# EAGLE design FA_2021_PCB (EAGLE 9.6.2)
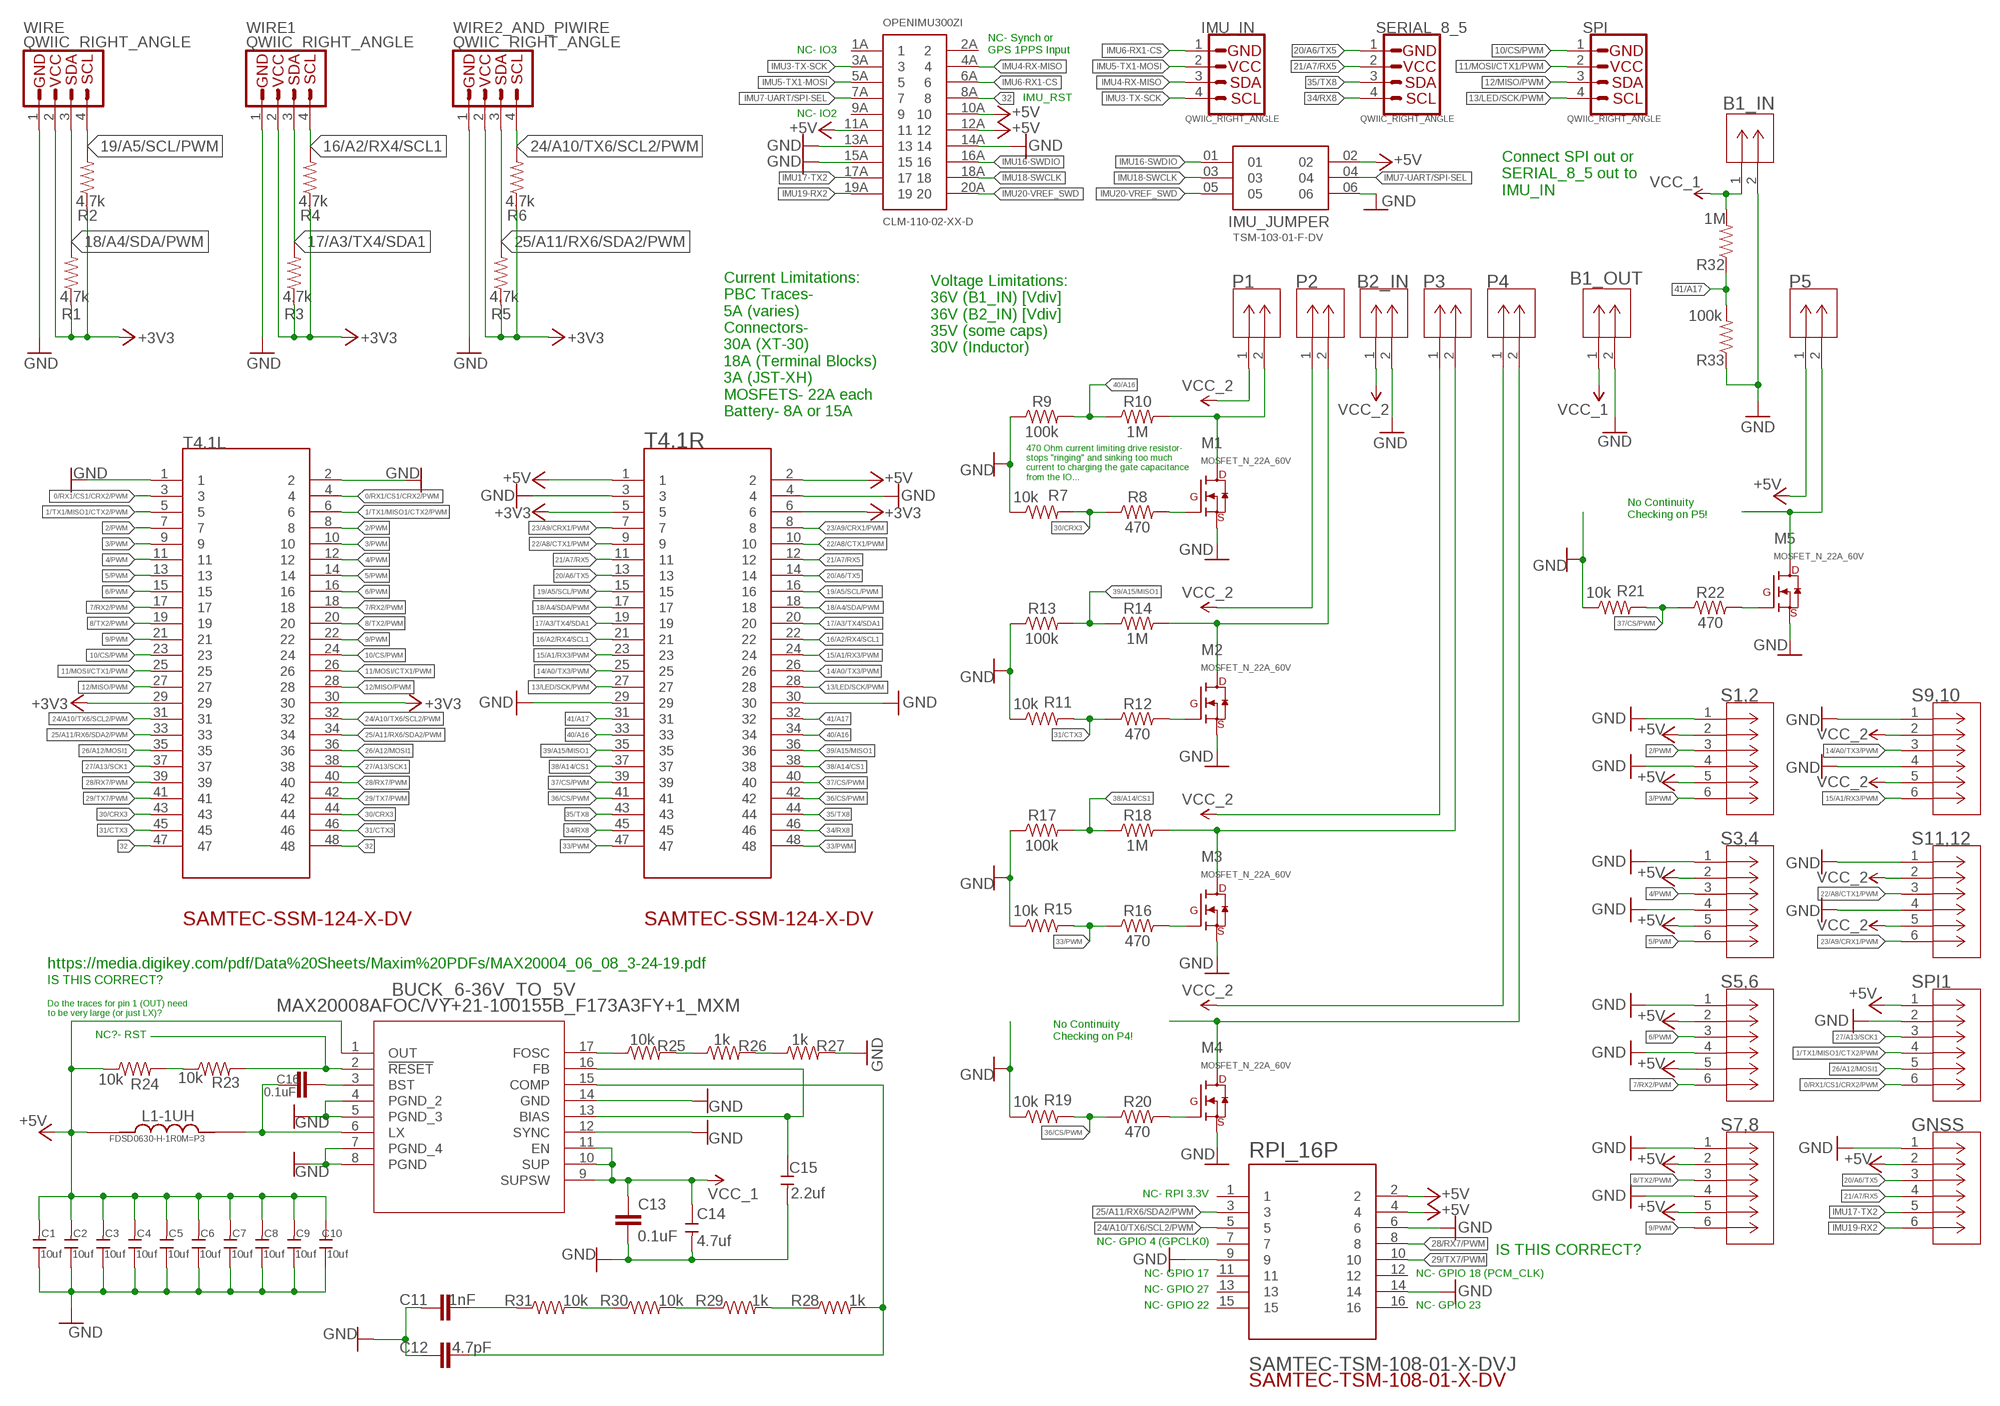
[diagram p0: schematic, sheet 1]

## Parts
B1_IN  TERMINAL_BLOCK_2P_5MMCONN_1935161_PXC  [CONN_1935161_PXC]
B1_OUT  TERMINAL_BLOCK_2P_5MMCONN_1935161_PXC  [CONN_1935161_PXC]
B2_IN  TERMINAL_BLOCK_2P_5MMCONN_1935161_PXC  [CONN_1935161_PXC]
BUCK_6-36V_TO_5V  MAX20008AFOC/VY+21-100155B_F173A3FY+1_MXM  [21-100155B_F173A3FY+1_MXM]
C1  10uf  CERAMIC-10UF-25V-10%-X5R(1206)  [C1206]
C2  10uf  CERAMIC-10UF-25V-10%-X5R(1206)  [C1206]
C3  10uf  CERAMIC-10UF-25V-10%-X5R(1206)  [C1206]
C4  10uf  CERAMIC-10UF-25V-10%-X5R(1206)  [C1206]
C5  10uf  CERAMIC-10UF-25V-10%-X5R(1206)  [C1206]
C6  10uf  CERAMIC-10UF-25V-10%-X5R(1206)  [C1206]
C7  10uf  CERAMIC-10UF-25V-10%-X5R(1206)  [C1206]
C8  10uf  CERAMIC-10UF-25V-10%-X5R(1206)  [C1206]
C9  10uf  CERAMIC-10UF-25V-10%-X5R(1206)  [C1206]
C10  10uf  CERAMIC-10UF-25V-10%-X5R(1206)  [C1206]
C11  1nF  1.0NF/1000PF-0603-50V-10%  [0603]
C12  4.7pF  4.7PF-0603-50V-5%  [0603]
C13  0.1uF  0.1UF-0603-100V-10%  [0603]
C14  4.7uf  CERAMIC-4.7UF-25V-10%-X5R(0805)  [C0805]
C15  2.2uf  CERAMIC-2.2UF-25V-10%-X7R(0805)  [C0805]
C16  0.1uF  0.1UF-0603-100V-10%  [0603]
GNSS  S6B-XH-SM4-TB(LF)(SN)CONN_S6B-XH-SM4-TB_JST  [CONN_S6B-XH-SM4-TB_JST]
IMU_IN  QWIIC_RIGHT_ANGLE  QWIIC_CONNECTORJS-1MM  [JST04_1MM_RA]
IMU_JUMPER  TSM-103-01-F-DV  [SAMTEC_TSM-103-01-F-DV]
L1-1UH  FDSD0630-H-1R0M=P3  [IND_FDSD0630-H-1R0M=P3]
M1  MOSFET_N_22A_60V  [SOT-669_LFPAK56_POWERSO8]
M2  MOSFET_N_22A_60V  [SOT-669_LFPAK56_POWERSO8]
M3  MOSFET_N_22A_60V  [SOT-669_LFPAK56_POWERSO8]
M4  MOSFET_N_22A_60V  [SOT-669_LFPAK56_POWERSO8]
M5  MOSFET_N_22A_60V  [SOT-669_LFPAK56_POWERSO8]
OPENIMU300ZI  CLM-110-02-XX-D  [CLM-110-02-XX-D_MOD]
P1  TERMINAL_BLOCK_2P_5MMCONN_1935161_PXC  [CONN_1935161_PXC]
P2  TERMINAL_BLOCK_2P_5MMCONN_1935161_PXC  [CONN_1935161_PXC]
P3  TERMINAL_BLOCK_2P_5MMCONN_1935161_PXC  [CONN_1935161_PXC]
P4  TERMINAL_BLOCK_2P_5MMCONN_1935161_PXC  [CONN_1935161_PXC]
P5  TERMINAL_BLOCK_2P_5MMCONN_1935161_PXC  [CONN_1935161_PXC]
R1  4.7k  4.7KOHM-0603-1/10W-1%  [0603]
R2  4.7k  4.7KOHM-0603-1/10W-1%  [0603]
R3  4.7k  4.7KOHM-0603-1/10W-1%  [0603]
R4  4.7k  4.7KOHM-0603-1/10W-1%  [0603]
R5  4.7k  4.7KOHM-0603-1/10W-1%  [0603]
R6  4.7k  4.7KOHM-0603-1/10W-1%  [0603]
R7  10k  10KOHM-0603-1/10W-1%  [0603]
R8  470  470OHM-0603-1/10W-1%  [0603]
R9  100k  100KOHM-0603-1/10W-1%  [0603]
R10  1M  1MOHM-0603-1/4W-5%  [0603]
R11  10k  10KOHM-0603-1/10W-1%  [0603]
R12  470  470OHM-0603-1/10W-1%  [0603]
R13  100k  100KOHM-0603-1/10W-1%  [0603]
R14  1M  1MOHM-0603-1/4W-5%  [0603]
R15  10k  10KOHM-0603-1/10W-1%  [0603]
R16  470  470OHM-0603-1/10W-1%  [0603]
R17  100k  100KOHM-0603-1/10W-1%  [0603]
R18  1M  1MOHM-0603-1/4W-5%  [0603]
R19  10k  10KOHM-0603-1/10W-1%  [0603]
R20  470  470OHM-0603-1/10W-1%  [0603]
R21  10k  10KOHM-0603-1/10W-1%  [0603]
R22  470  470OHM-0603-1/10W-1%  [0603]
R23  10k  10KOHM-0603-1/10W-1%  [0603]
R24  10k  10KOHM-0603-1/10W-1%  [0603]
R25  10k  10KOHM-0603-1/10W-1%  [0603]
R26  1k  1KOHM-0603-1/10W-1%  [0603]
R27  1k  1KOHM-0603-1/10W-1%  [0603]
R28  1k  1KOHM-0603-1/10W-1%  [0603]
R29  1k  1KOHM-0603-1/10W-1%  [0603]
R30  10k  10KOHM-0603-1/10W-1%  [0603]
R31  10k  10KOHM-0603-1/10W-1%  [0603]
R32  1M  1MOHM-0603-1/4W-5%  [0603]
R33  100k  100KOHM-0603-1/10W-1%  [0603]
RPI_16P  SAMTEC-TSM-108-01-X-DVJ  [SAMTEC-TSM-108-01-X-DV]
S1,2  S6B-XH-SM4-TB(LF)(SN)CONN_S6B-XH-SM4-TB_JST  [CONN_S6B-XH-SM4-TB_JST]
S3,4  S6B-XH-SM4-TB(LF)(SN)CONN_S6B-XH-SM4-TB_JST  [CONN_S6B-XH-SM4-TB_JST]
S5,6  S6B-XH-SM4-TB(LF)(SN)CONN_S6B-XH-SM4-TB_JST  [CONN_S6B-XH-SM4-TB_JST]
S7,8  S6B-XH-SM4-TB(LF)(SN)CONN_S6B-XH-SM4-TB_JST  [CONN_S6B-XH-SM4-TB_JST]
S9,10  S6B-XH-SM4-TB(LF)(SN)CONN_S6B-XH-SM4-TB_JST  [CONN_S6B-XH-SM4-TB_JST]
S11,12  S6B-XH-SM4-TB(LF)(SN)CONN_S6B-XH-SM4-TB_JST  [CONN_S6B-XH-SM4-TB_JST]
SERIAL_8_5  QWIIC_RIGHT_ANGLE  QWIIC_CONNECTORJS-1MM  [JST04_1MM_RA]
SPI  QWIIC_RIGHT_ANGLE  QWIIC_CONNECTORJS-1MM  [JST04_1MM_RA]
SPI1  S6B-XH-SM4-TB(LF)(SN)CONN_S6B-XH-SM4-TB_JST  [CONN_S6B-XH-SM4-TB_JST]
T4.1L  SAMTEC-SSM-124-X-DVJ  [SAMTEC-SSM-124-X-DV]
T4.1R  SAMTEC-SSM-124-X-DVJ  [SAMTEC-SSM-124-X-DV]
WIRE  QWIIC_RIGHT_ANGLE  QWIIC_CONNECTORJS-1MM  [JST04_1MM_RA]
WIRE1  QWIIC_RIGHT_ANGLE  QWIIC_CONNECTORJS-1MM  [JST04_1MM_RA]
WIRE2_AND_PIWIRE  QWIIC_RIGHT_ANGLE  QWIIC_CONNECTORJS-1MM  [JST04_1MM_RA]

## Nets
0/RX1/CS1/CRX2/PWM: SPI1.6 T4.1L.3 T4.1L.4
1/TX1/MISO1/CTX2/PWM: SPI1.4 T4.1L.5 T4.1L.6
2/PWM: S1,2.3 T4.1L.7 T4.1L.8
3/PWM: S1,2.6 T4.1L.9 T4.1L.10
4/PWM: S3,4.3 T4.1L.11 T4.1L.12
5/PWM: S3,4.6 T4.1L.13 T4.1L.14
6/PWM: S5,6.3 T4.1L.15 T4.1L.16
7/RX2/PWM: S5,6.6 T4.1L.17 T4.1L.18
8/TX2/PWM: S7,8.3 T4.1L.19 T4.1L.20
9/PWM: S7,8.6 T4.1L.21 T4.1L.22
10/CS/PWM: SPI.1 T4.1L.23 T4.1L.24
11/MOSI/CTX1/PWM: SPI.2 T4.1L.25 T4.1L.26
12/MISO/PWM: SPI.3 T4.1L.27 T4.1L.28
13/LED/SCK/PWM: SPI.4 T4.1R.27 T4.1R.28
14/A0/TX3/PWM: S9,10.3 T4.1R.25 T4.1R.26
15/A1/RX3/PWM: S9,10.6 T4.1R.23 T4.1R.24
16/A2/RX4/SCL1: R4.2 T4.1R.21 T4.1R.22 WIRE1.4
17/A3/TX4/SDA1: R3.2 T4.1R.19 T4.1R.20 WIRE1.3
18/A4/SDA/PWM: R1.2 T4.1R.17 T4.1R.18 WIRE.3
19/A5/SCL/PWM [Power Delivery]: R2.2 T4.1R.15 T4.1R.16 WIRE.4
20/A6/TX5: GNSS.3 SERIAL_8_5.1 T4.1R.13 T4.1R.14
21/A7/RX5: GNSS.4 SERIAL_8_5.2 T4.1R.11 T4.1R.12
22/A8/CTX1/PWM: S11,12.3 T4.1R.9 T4.1R.10
23/A9/CRX1/PWM: S11,12.6 T4.1R.7 T4.1R.8
24/A10/TX6/SCL2/PWM: R6.2 RPI_16P.5 T4.1L.31 T4.1L.32 WIRE2_AND_PIWIRE.4
25/A11/RX6/SDA2/PWM: R5.2 RPI_16P.3 T4.1L.33 T4.1L.34 WIRE2_AND_PIWIRE.3
26/A12/MOSI1 [Power Delivery]: SPI1.5 T4.1L.35 T4.1L.36
27/A13/SCK1: SPI1.3 T4.1L.37 T4.1L.38
28/RX7/PWM: RPI_16P.8 T4.1L.39 T4.1L.40
29/TX7/PWM: RPI_16P.10 T4.1L.41 T4.1L.42
30/CRX3: R7.2 R8.1 T4.1L.43 T4.1L.44
31/CTX3: R11.2 R12.1 T4.1L.45 T4.1L.46
32: OPENIMU300ZI.8A T4.1L.47 T4.1L.48
33/PWM: R15.2 R16.1 T4.1R.47 T4.1R.48
34/RX8: SERIAL_8_5.4 T4.1R.45 T4.1R.46
35/TX8: SERIAL_8_5.3 T4.1R.43 T4.1R.44
36/CS/PWM: R19.2 R20.1 T4.1R.41 T4.1R.42
37/CS/PWM: R21.2 R22.1 T4.1R.39 T4.1R.40
38/A14/CS1: R17.2 R18.1 T4.1R.37 T4.1R.38
39/A15/MISO1: R13.2 R14.1 T4.1R.35 T4.1R.36
40/A16: R9.2 R10.1 T4.1R.33 T4.1R.34
41/A17: R32.1 R33.2 T4.1R.31 T4.1R.32
+3V3: R1.1 R2.1 R3.1 R4.1 R5.1 R6.1 T4.1L.29 T4.1L.30 T4.1R.5 T4.1R.6 WIRE1.2 WIRE2_AND_PIWIRE.2 WIRE.2
+5V: BUCK_6-36V_TO_5V.1(OUT) C1.2 C2.2 C3.2 C4.2 C5.2 C6.2 C7.2 C8.2 C9.2 C10.2 GNSS.2 IMU_JUMPER.02 L1-1UH.1 OPENIMU300ZI.10A OPENIMU300ZI.11A OPENIMU300ZI.12A P5.1 R24.1 RPI_16P.2 RPI_16P.4 S1,2.2 S1,2.5 S3,4.2 S3,4.5 S5,6.2 S5,6.5 S7,8.2 S7,8.5 SPI1.1 T4.1R.1 T4.1R.2
BIAS/FB: BUCK_6-36V_TO_5V.13(BIAS) BUCK_6-36V_TO_5V.16(FB) C15.1
BST: BUCK_6-36V_TO_5V.3(BST) C16.2
BUCK_RST: BUCK_6-36V_TO_5V.2(!RESET) R23.2
COMP: BUCK_6-36V_TO_5V.15(COMP) C12.2 R28.2
FOSC: BUCK_6-36V_TO_5V.17(FOSC) R25.1
GND: B1_IN.2 B1_OUT.2 B2_IN.2 BUCK_6-36V_TO_5V.4(PGND_2) BUCK_6-36V_TO_5V.5(PGND_3) BUCK_6-36V_TO_5V.7(PGND_4) BUCK_6-36V_TO_5V.8(PGND) BUCK_6-36V_TO_5V.12(SYNC) BUCK_6-36V_TO_5V.14(GND) C1.1 C2.1 C3.1 C4.1 C5.1 C6.1 C7.1 C8.1 C9.1 C10.1 C11.1 C12.1 C13.2 C14.2 C15.2 GNSS.1 IMU_JUMPER.06 M1.1(S) M1.2(S) M1.3(S) M2.1(S) M2.2(S) M2.3(S) M3.1(S) M3.2(S) M3.3(S) M4.1(S) M4.2(S) M4.3(S) M5.1(S) M5.2(S) M5.3(S) OPENIMU300ZI.13A OPENIMU300ZI.14A OPENIMU300ZI.15A R7.1 R9.1 R11.1 R13.1 R15.1 R17.1 R19.1 R21.1 R27.2 R33.1 RPI_16P.6 RPI_16P.9 RPI_16P.14 S1,2.1 S1,2.4 S3,4.1 S3,4.4 S5,6.1 S5,6.4 S7,8.1 S7,8.4 S9,10.1 S9,10.4 S11,12.1 S11,12.4 SPI1.2 T4.1L.1 T4.1L.2 T4.1R.3 T4.1R.4 T4.1R.29 T4.1R.30 WIRE1.1 WIRE2_AND_PIWIRE.1 WIRE.1
IMU3-TX-SCK: IMU_IN.4 OPENIMU300ZI.3A
IMU4-RX-MISO: IMU_IN.3 OPENIMU300ZI.4A
IMU5-TX1-MOSI: IMU_IN.2 OPENIMU300ZI.5A
IMU6-RX1-CS: IMU_IN.1 OPENIMU300ZI.6A
IMU7-UART/SPI-SEL: IMU_JUMPER.04 OPENIMU300ZI.7A
IMU16-SWDIO: IMU_JUMPER.01 OPENIMU300ZI.16A
IMU17-TX2: GNSS.5 OPENIMU300ZI.17A
IMU18-SWCLK: IMU_JUMPER.03 OPENIMU300ZI.18A
IMU19-RX2: GNSS.6 OPENIMU300ZI.19A
IMU20-VREF_SWD: IMU_JUMPER.05 OPENIMU300ZI.20A
LX: BUCK_6-36V_TO_5V.6(LX) C16.1 L1-1UH.2
N$2: M1.4(G) R8.2
N$5: M5.4(G) R22.2
N$8: R23.1 R24.2
N$10: M2.4(G) R12.2
N$12: R25.2 R26.1
N$13: R26.2 R27.1
N$14: R30.1 R31.2
N$15: R29.1 R30.2
N$16: R28.1 R29.2
N$17: M3.4(G) R16.2
N$19: C11.2 R31.1
N$24: M4.4(G) R20.2
P1D: M1.5(D) P1.2 R10.2
P2D: M2.5(D) P2.2 R14.2
P3D: M3.5(D) P3.2 R18.2
P4D: M4.5(D) P4.2
P5D: M5.5(D) P5.2
VCC_1: B1_IN.1 B1_OUT.1 BUCK_6-36V_TO_5V.9(SUPSW) BUCK_6-36V_TO_5V.10(SUP) BUCK_6-36V_TO_5V.11(EN) C13.1 C14.1 R32.2
VCC_2: B2_IN.1 P1.1 P2.1 P3.1 P4.1 S9,10.2 S9,10.5 S11,12.2 S11,12.5
Unconnected: OPENIMU300ZI.1A OPENIMU300ZI.2A OPENIMU300ZI.9A RPI_16P.1 RPI_16P.7 RPI_16P.11 RPI_16P.12 RPI_16P.13 RPI_16P.15 RPI_16P.16

## Notes on the sheet
- NC- IO3
- NC- Synch or 
  GPS 1PPS Input
- IMU_RST
- NC- IO2
- Connect SPI out or 
  SERIAL_8_5 out to 
  IMU_IN
- Voltage Limitations:
  36V (B1_IN) [Vdiv]
  36V (B2_IN) [Vdiv]
  35V (some caps)
  30V (Inductor)
- Current Limitations:
  PBC Traces- 
  5A (varies)
  Connectors- 
  30A (XT-30)
  18A (Terminal Blocks)
  3A (JST-XH)
  MOSFETS- 22A each
  Battery- 8A or 15A
- 470 Ohm current limiting drive resistor-
  stops "ringing" and sinking too much
  current to charging the gate capacitance 
  from the IO...
- No Continuity 
  Checking on P5!
- https://media.digikey.com/pdf/Data%20Sheets/Maxim%20PDFs/MAX20004_06_08_3-24-19.pdf
- IS THIS CORRECT?
- Do the traces for pin 1 (OUT) need 
  to be very large (or just LX)?
- NC?- RST
- No Continuity 
  Checking on P4!
- NC- RPI 3.3V
- NC- GPIO 4 (GPCLK0)
- IS THIS CORRECT?
- NC- GPIO 17 | NC- GPIO 18 (PCM_CLK)
- NC- GPIO 27
- NC- GPIO 22 | NC- GPIO 23

## Library data of the parts
B1_IN B1_OUT B2_IN P1-P5 = Terminal_Block_2p_5mm:TERMINAL_BLOCK_2P_5MM; BUILT_BY: EMA_Justin; COPYRIGHT: Copyright (C) 2018 Accelerated Designs. All rights reserved; MANUFACTURER_PART_NUMBER: 1935161; SOURCELIBRARY: Phoenix_Contact_2019-12-04; VENDOR: Phoenix Contact
BUCK_6-36V_TO_5V = MAX20008AFOC_Library:MAX20008AFOC/VY+; BUILT_BY: EMA_Jessica; COPYRIGHT: Copyright (C) 2018 Accelerated Designs. All rights reserved; MANUFACTURER_PART_NUMBER: MAX20008AFOC/VY+; SOURCELIBRARY: Maxim_2019-06-26; VENDOR: Maxim Integrated Products
C1-C10 = OPL_Capacitor:CERAMIC-10UF-25V-10%-X5R(1206): 302010181; MPN: CC1206KKX5R8BB106
C11 = SparkFun-Capacitors:1.0NF/1000PF: 1nF/1,000pF ceramic capacitors A capacitor is a passive two-terminal electrical component used to store electrical energy temporarily in an electric field.; PROD_ID: CAP-07886
C12 = SparkFun-Capacitors:4.7PF: 4.7pF ceramic capacitors A capacitor is a passive two-terminal electrical component used to store electrical energy temporarily in an electric field.; PROD_ID: CAP-07880
C13 C16 = SparkFun-Capacitors:0.1UF: 0.1µF ceramic capacitors A capacitor is a passive two-terminal electrical component used to store electrical energy temporarily in an electric field.; PROD_ID: CAP-08390
C14 = OPL_Capacitor:CERAMIC-4.7UF-25V-10%-X5R(0805): 302010146; MPN: CC0805KKX5R8BB475
C15 = OPL_Capacitor:CERAMIC-2.2UF-25V-10%-X7R(0805): 302010148; MPN: CC0805KKX7R8BB225
GNSS S1,2 S3,4 S5,6 S7,8 S9,10 S11,12 SPI1 = JST-S6B-XH-SM4:S6B-XH-SM4-TB(LF)(SN); BUILT_BY: EMA_Cory; COPYRIGHT: Copyright (C) 2018 Accelerated Designs. All rights reserved; DATASHEET: http://www.jst-mfg.com/product/pdf/eng/eXH.pdf; MANUFACTURER_PART_NUMBER: S6B-XH-SM4-TB(LF)(SN); SOURCELIBRARY: Add_to_database_2020-12-04; VENDOR: JST
IMU_IN SERIAL_8_5 SPI WIRE WIRE1 WIRE2_AND_PIWIRE = MODIFIED-SparkFun-Connectors:QWIIC_CONNECTOR: SparkFun I2C Standard Qwiic Connector An SMD 1mm pitch JST connector makes it easy and quick (get it? Qwiic?) to connect I2C devices to each other. The Qwiic system <http://www.sparkfun.com/qwiic> enables fast and solderless connection between popular platforms and various sensors and actuators. We carry 200mm <https://www.sparkfun.com/products/14204>, 100mm <https://www.sparkfun.com/products/14205>, 50mm <https://www.sparkfun.com/products/14206>, and breadboard friendly <https://www.sparkfun.com/products/14207> Qwiic cables. We also offer 10 pcs strips <https://www.sparkfun.com/products/14323> the SMD connectors.; PROD_ID: CONN-13694
IMU_JUMPER = TSM-103-01-X-DV:TSM-103-01-F-DV; MANUFACTURER: SAMTEC
L1-1UH = FDSD0630-H-1R0M_P3:FDSD0630-H-1R0M=P3: 2.2µH Shielded Wirewound Inductor 7.1A 17mOhm Max Nonstandard; DESCRIPTION: Inductor with Inductance: 1uH Tol. +/-20%, Package: 2726 (7066); DIGI-KEY_PART_NUMBER: 490-10878-1-ND; MF: Murata; MP: FDSD0630-H-1R0M=P3; PACKAGE: NONSTANDARD
M1-M5 = BUK9Y43-60E:MOSFET_N_22A_60V
OPENIMU300ZI = CLM-110-02-XX-D:CLM-110-02-XX-D: LOW PROFILE 1MMX1MM DOUBLE ROW BODY. MANUFACTURER:SAMTEC.
R1-R6 = SparkFun-Resistors:4.7KOHM: 4.7kΩ resistor A resistor is a passive two-terminal electrical component that implements electrical resistance as a circuit element. Resistors act to reduce current flow, and, at the same time, act to lower voltage levels within circuits. - Wikipedia; PROD_ID: RES-07857
R7 R11 R15 R19 R21 R23-R25 R30 R31 = SparkFun-Resistors:10KOHM: 10kΩ resistor A resistor is a passive two-terminal electrical component that implements electrical resistance as a circuit element. Resistors act to reduce current flow, and, at the same time, act to lower voltage levels within circuits. - Wikipedia; PROD_ID: RES-00824
R8 R12 R16 R20 R22 = SparkFun-Resistors:470OHM: 470Ω resistor A resistor is a passive two-terminal electrical component that implements electrical resistance as a circuit element. Resistors act to reduce current flow, and, at the same time, act to lower voltage levels within circuits. - Wikipedia; PROD_ID: RES-07869
R9 R13 R17 R33 = SparkFun-Resistors:100KOHM: 100kΩ resistor A resistor is a passive two-terminal electrical component that implements electrical resistance as a circuit element. Resistors act to reduce current flow, and, at the same time, act to lower voltage levels within circuits. - Wikipedia; PROD_ID: RES-07828
R10 R14 R18 R32 = SparkFun-Resistors:1MOHM: 1MΩ resistor A resistor is a passive two-terminal electrical component that implements electrical resistance as a circuit element. Resistors act to reduce current flow, and, at the same time, act to lower voltage levels within circuits. - Wikipedia; PROD_ID: RES-07868
R26-R29 = SparkFun-Resistors:1KOHM: 1kΩ resistor A resistor is a passive two-terminal electrical component that implements electrical resistance as a circuit element. Resistors act to reduce current flow, and, at the same time, act to lower voltage levels within circuits. - Wikipedia; PROD_ID: RES-07856
RPI_16P = SAMTEC-TSM-108-01-X-DV:SAMTEC-TSM-108-01-X-DV; AVAILABILITY: Unavailable; DESCRIPTION: CONN HEADER SMD 16POS 2.54MM; MF: Samtec Inc.; MP: TSM-108-01-T-DV; PACKAGE: None; PRICE: None
T4.1L T4.1R = SAMTEC-SSM-124-X-DV:SAMTEC-SSM-124-X-DV

## Net classes
1 Power Delivery: width 0.25 mm

## Board
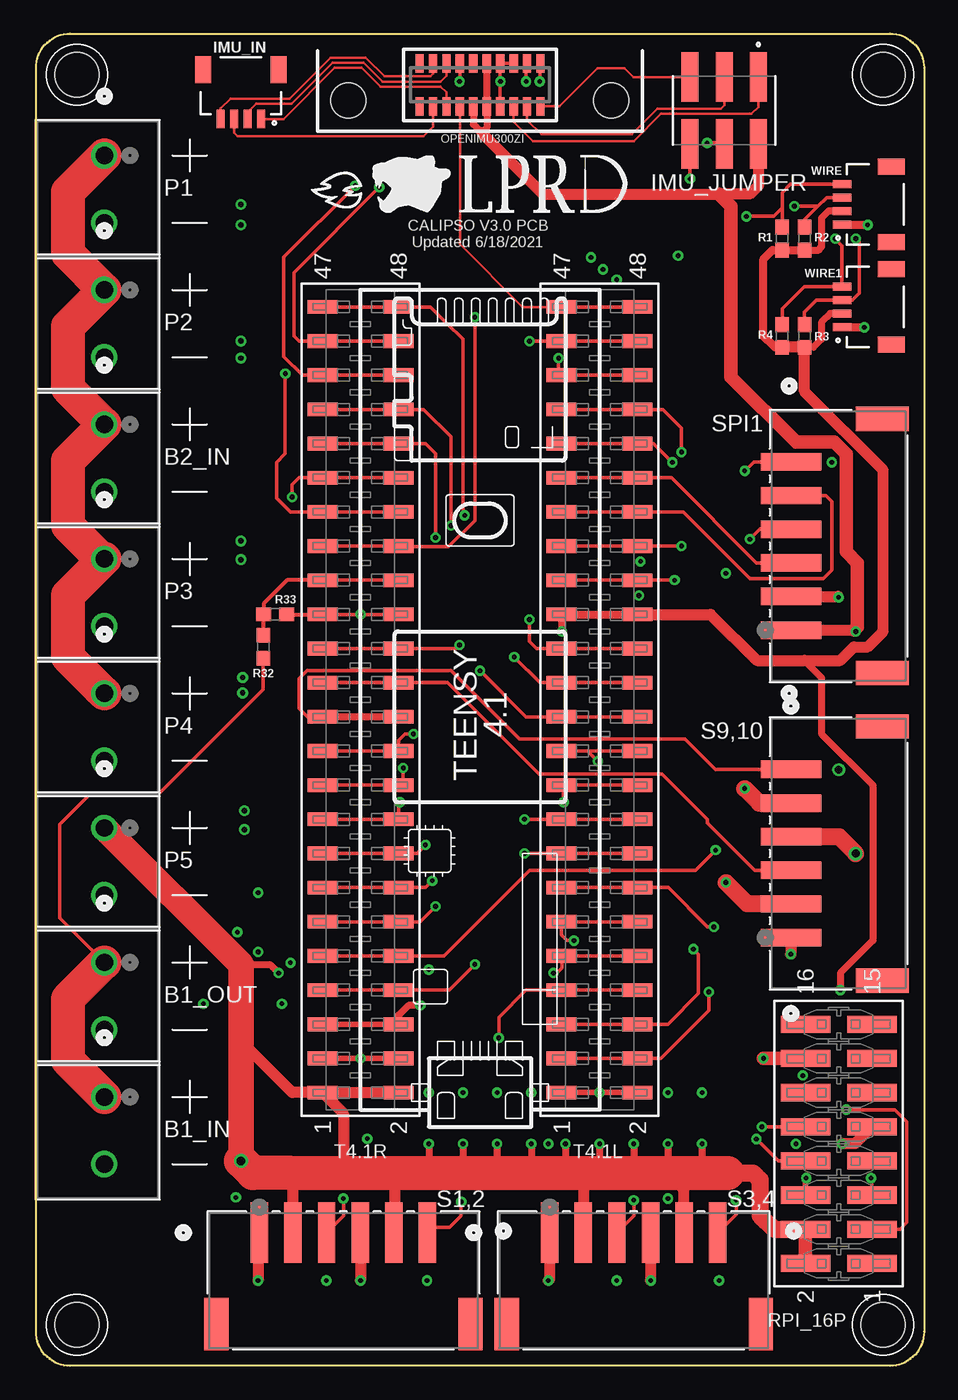
[diagram p1: board, top side]
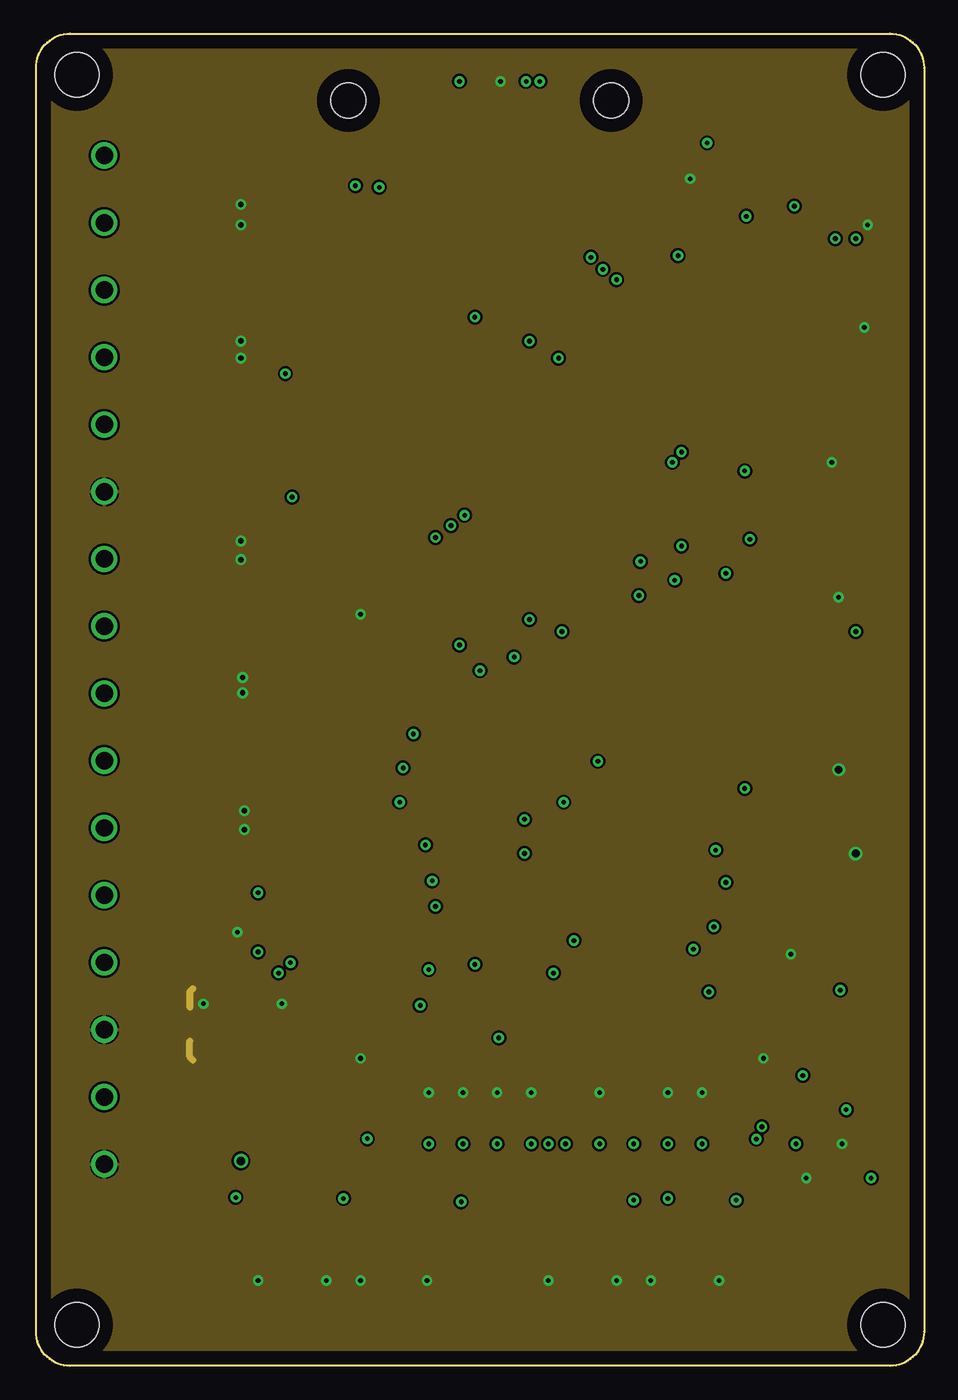
[diagram p2: board, inner layer Route2]
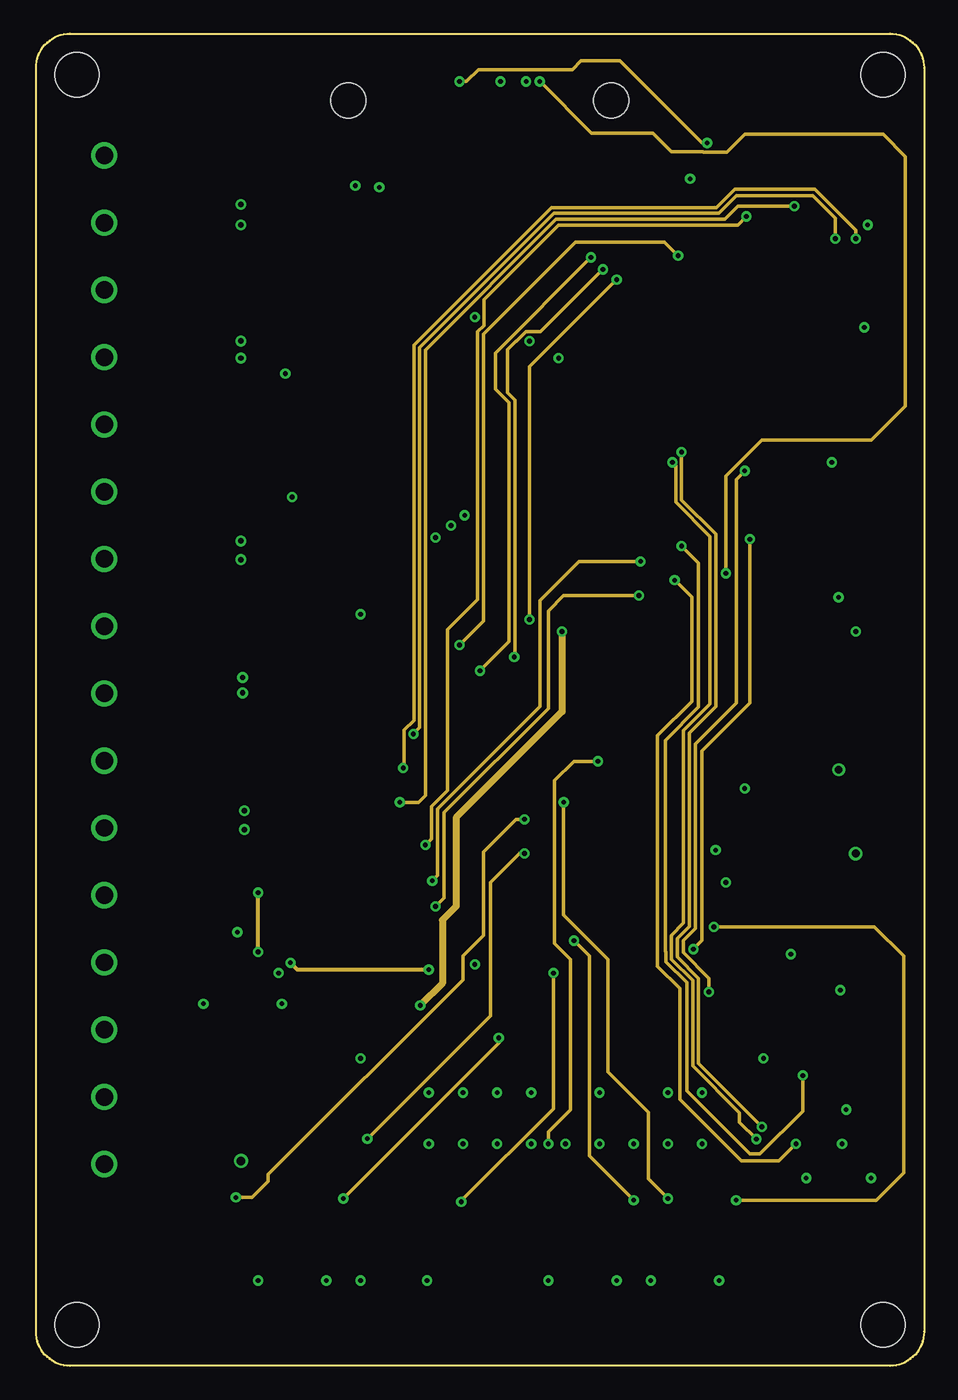
[diagram p3: board, inner layer Route15]
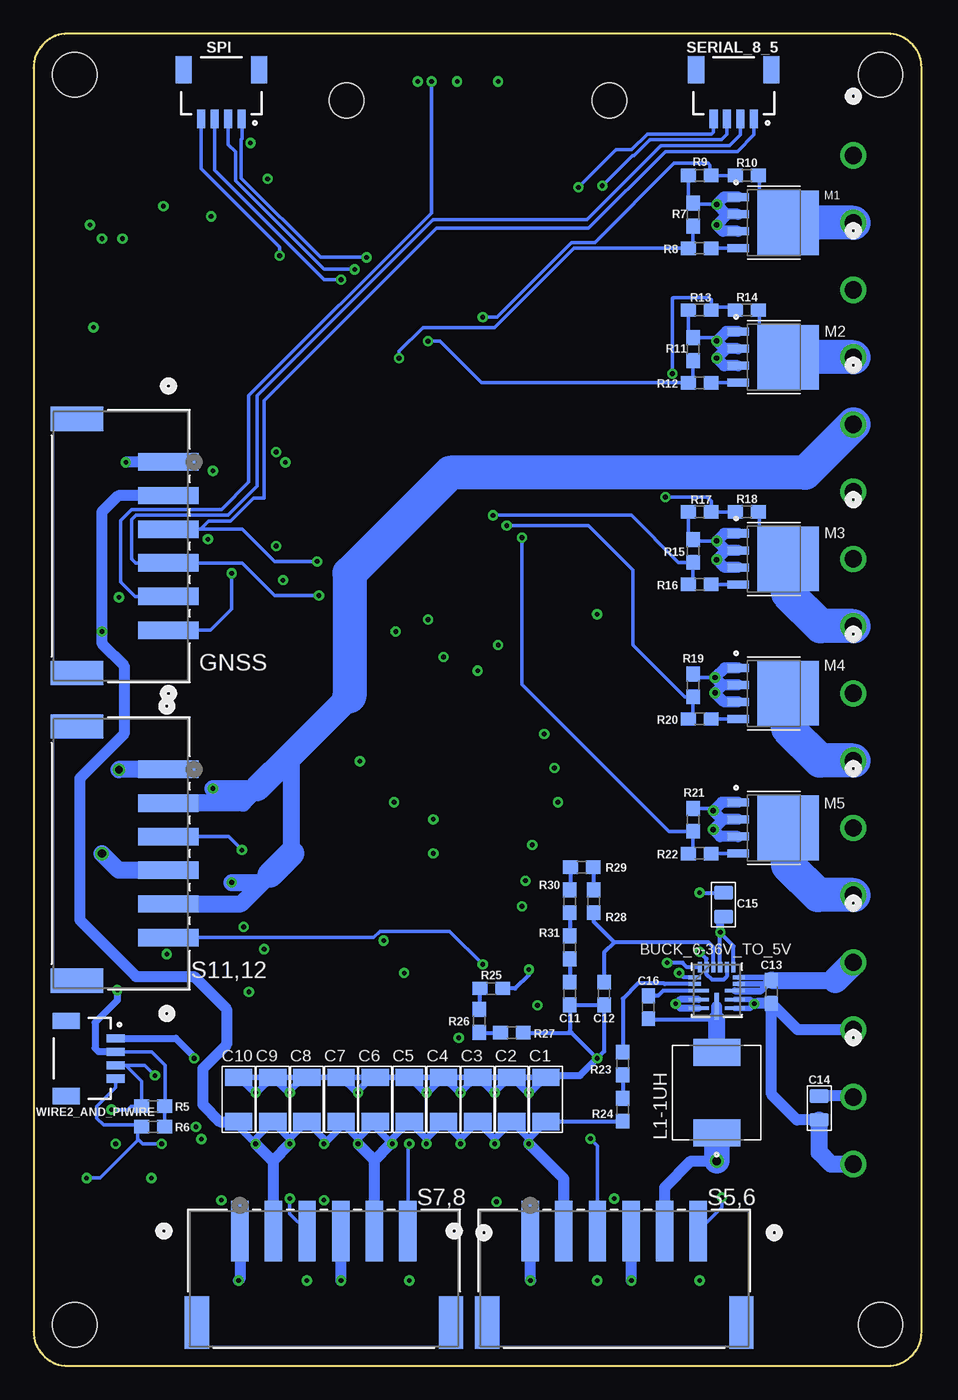
[diagram p4: board, bottom side, seen from below]

Size 66.04 x 99.06 mm. Coordinates in mm from the lower left corner, seen from the top.
Outline: 0,2.54 0,96.52 arc-90 2.54,99.06 63.5,99.06 arc-90 66.04,96.52 66.04,2.54 arc-90 63.5,0 2.54,0 arc-90 0,2.54
Copper layers (1+2*15+16): Top 0.035mm / dielectric 0.2221mm / Route2 0.035mm / dielectric 39mil / Route15 0.035mm / dielectric 0.2221mm / Bottom 0.035mm
Design rules "default *": minimum track width 7mil, minimum drill 0.35mm, track to track 7mil, track to pad 7mil, pad to pad 7mil, via to via 7mil, smd to smd 7mil, copper to edge 40mil, drill to drill 7mil, minimum pad ring 10mil, minimum via ring 8mil, stop-mask expansion 4mil, vias tented up to drill 0mil, thermal gap 5mil
Holes 3.3 mm at 3.05,3.05 62.99,3.05 62.99,96.01 3.05,96.01
Holes 2.6 mm at 42.77,94.1 23.21,94.1

### Footprints (pad centres in the part's own frame; a part is rotated, then mirrored left to right if it is on the bottom)
CONN_1935161_PXC = drill 1.295 pad 1.803: 1 0,0; 2 5,0
21-100155B_F173A3FY+1_MXM = smd 0.914 x 0.305: 1 -1.641,0.95; 2 -1.641,0.45; 10 1.641,0.45; 11 1.641,0.95 | smd 1.499 x 0.254: 3 -1.349,-0.05; 4 -1.349,-0.7; 5 -1.349,-1.35; 7 1.349,-1.35; 8 1.349,-0.7; 9 1.349,-0.05 | smd 0.356 x 2: 6 0,-1.225 | smd 0.305 x 0.813: 12 1.25,1.706; 13 0.75,1.706; 14 0.25,1.706; 15 -0.25,1.706; 16 -0.75,1.706; 17 -1.25,1.706
C1206 = smd 1.27 x 2.032: 1 -1.651,0; 2 1.651,0
0603 = smd 1.1 x 1: 1 -0.85,0; 2 0.85,0
C0805 = smd 1.397 x 1.016: 1 0,0.889; 2 0,-0.889
CONN_S6B-XH-SM4-TB_JST = smd 1.295 x 4.496: 1 -6.25,3.554; 2 -3.75,3.554; 3 -1.25,3.554; 4 1.25,3.554; 5 3.75,3.554; 6 6.25,3.554 | smd 1.803 x 3.912: 7 -9.45,-3.246; 8 9.45,-3.246
JST04_1MM_RA = smd 0.6 x 1.35: 1 -1.5,0; 2 -0.5,0; 3 0.5,0; 4 1.5,0 | smd 1.2 x 2: NC1 2.8,-3.675; NC2 -2.8,-3.675
SAMTEC_TSM-103-01-F-DV = smd 1.27 x 3.68: 01 2.54,2.475; 02 2.54,-2.475; 03 0,2.475; 04 0,-2.475; 05 -2.54,2.475; 06 -2.54,-2.475
IND_FDSD0630-H-1R0M=P3 = smd 2 x 3.5: 1 -3,0; 2 3,0
SOT-669_LFPAK56_POWERSO8 = smd 0.6 x 1.62: 1 -1.905,-2.65; 2 -0.635,-2.65; 3 0.635,-2.65; 4 1.905,-2.65 | smd 4.8 x 4.58: 5 0,1.06
CLM-110-02-XX-D_MOD = smd 0.61 x 1.372: 1A -4.503,1.6; 2A -4.503,-1.6; 3A -3.503,1.6; 4A -3.503,-1.6; 5A -2.502,1.6; 6A -2.502,-1.6; 7A -1.501,1.6; 8A -1.501,-1.6; 9A -0.5,1.6; 10A -0.5,-1.6; 11A 0.5,1.6; 12A 0.5,-1.6; 13A 1.501,1.6; 14A 1.501,-1.6; 15A 2.502,1.6; 16A 2.502,-1.6; 17A 3.503,1.6; 18A 3.503,-1.6; 19A 4.503,1.6; 20A 4.503,-1.6
SAMTEC-TSM-108-01-X-DV = smd 1.27 x 3.68: 1 -8.89,-2.476; 2 -8.89,2.476; 3 -6.35,-2.476; 4 -6.35,2.476; 5 -3.81,-2.476; 6 -3.81,2.476; 7 -1.27,-2.476; 8 -1.27,2.476; 9 1.27,-2.476; 10 1.27,2.476; 11 3.81,-2.476; 12 3.81,2.476; 13 6.35,-2.476; 14 6.35,2.476; 15 8.89,-2.476; 16 8.89,2.476
SAMTEC-SSM-124-X-DV = smd 1.02 x 2.22: 1 -29.21,2.826; 2 -29.21,-2.826; 3 -26.67,2.826; 4 -26.67,-2.826; 5 -24.13,2.826; 6 -24.13,-2.826; 7 -21.59,2.826; 8 -21.59,-2.826; 9 -19.05,2.826; 10 -19.05,-2.826; 11 -16.51,2.826; 12 -16.51,-2.826; 13 -13.97,2.826; 14 -13.97,-2.826; 15 -11.43,2.826; 16 -11.43,-2.826; 17 -8.89,2.826; 18 -8.89,-2.826; 19 -6.35,2.826; 20 -6.35,-2.826; 21 -3.81,2.826; 22 -3.81,-2.826; 23 -1.27,2.826; 24 -1.27,-2.826; 25 1.27,2.826; 26 1.27,-2.826; 27 3.81,2.826; 28 3.81,-2.826; 29 6.35,2.826; 30 6.35,-2.826; 31 8.89,2.826; 32 8.89,-2.826; 33 11.43,2.826; 34 11.43,-2.826; 35 13.97,2.826; 36 13.97,-2.826; 37 16.51,2.826; 38 16.51,-2.826; 39 19.05,2.826; 40 19.05,-2.826; 41 21.59,2.826; 42 21.59,-2.826; 43 24.13,2.826; 44 24.13,-2.826; 45 26.67,2.826; 46 26.67,-2.826; 47 29.21,2.826; 48 29.21,-2.826

### Placement (x,y rotation side)
B1_IN  5.08,20 270 top
B1_OUT  5.08,30 270 top
B2_IN  5.08,70 270 top
BUCK_6-36V_TO_5V  15.24,27.94 0 bottom
C1  27.94,19.81 270 bottom
C2  30.48,19.81 270 bottom
C3  33.02,19.81 270 bottom
C4  35.56,19.81 270 bottom
C5  38.1,19.81 270 bottom
C6  40.64,19.81 270 bottom
C7  43.18,19.81 270 bottom
C8  45.72,19.81 270 bottom
C9  48.26,19.81 270 bottom
C10  50.8,19.81 270 bottom
C11  26.16,27.69 90 bottom
C12  23.62,27.69 90 bottom
C13  11.18,27.81 270 bottom
C14  7.62,19.18 0 bottom
C15  14.73,34.29 0 bottom
C16  20.32,26.67 90 bottom
GNSS  59.56,60.96 270 bottom
IMU_IN  15.24,92.71 180 top
IMU_JUMPER  51.18,93.34 0 top
L1-1UH  15.24,20.32 90 bottom
M1  11,85 270 bottom
M2  11,75 270 bottom
M3  11,60 270 bottom
M4  11,50 270 bottom
M5  11,40 270 bottom
OPENIMU300ZI  33.02,95.25 0 top
P1  5.08,90 270 top
P2  5.08,80 270 top
P3  5.08,60 270 top
P4  5.08,50 270 top
P5  5.08,40 270 top
R1  57.15,83.82 90 top
R2  55.5,83.82 90 top
R3  57.15,76.58 90 top
R4  55.5,76.58 90 top
R5  57.15,19.3 180 bottom
R6  57.15,17.78 180 bottom
R7  17,85.6 270 bottom
R8  16.5,83.1 0 bottom
R9  16.5,88.5 0 bottom
R10  13,88.5 0 bottom
R11  17,75.6 270 bottom
R12  16.5,73.1 0 bottom
R13  16.5,78.5 0 bottom
R14  13,78.5 0 bottom
R15  17,60.6 270 bottom
R16  16.5,58.1 0 bottom
R17  16.5,63.5 0 bottom
R18  13,63.5 0 bottom
R19  17,50.6 270 bottom
R20  16.5,48.1 0 bottom
R21  17,40.6 270 bottom
R22  16.5,38.1 0 bottom
R23  22.23,22.48 90 bottom
R24  22.23,19.05 90 bottom
R25  32,28.07 180 bottom
R26  32.89,25.65 270 bottom
R27  30.48,24.77 0 bottom
R28  24.38,34.54 270 bottom
R29  25.27,37.08 0 bottom
R30  26.16,34.54 90 bottom
R31  26.16,31.11 90 bottom
R32  16.89,53.47 270 top
R33  17.78,55.88 180 top
RPI_16P  59.69,16.51 90 top
S1,2  22.86,6.35 0 top
S3,4  44.45,6.35 0 top
S5,6  22.86,6.48 0 bottom
S7,8  44.45,6.48 0 bottom
S9,10  59.69,38.1 90 top
S11,12  59.56,38.1 270 bottom
SERIAL_8_5  13.97,92.71 180 bottom
SPI  52.07,92.71 180 bottom
SPI1  59.69,60.96 90 top
T4.1L  41.91,49.53 90 top
T4.1R  24.13,49.53 90 top
U$1  [TEENSY_4.1_SILKSCREEN]  33.02,48.26 90 top
WIRE  59.94,86.36 90 top
WIRE1  59.94,78.74 90 top
WIRE2_AND_PIWIRE  59.94,22.86 270 bottom

### Tracks (layer width: path | path; a pad name or v marks a point on that pad's centre or on a via)
0/RX1/CS1/CRX2/PWM  (via drill 0.35)
  Top 0.254: T4.1L.3 T4.1L.4 46.48,22.86 50.04,26.42 v50.04,27.81 | SPI1.6 53.37,67.21 v52.7,66.55
  Route15 0.254: v52.7,66.55 52.07,65.91 52.07,49.28 49.02,46.23 49.02,32.51 48.13,31.62 48.13,30.73 50.04,28.83 v50.04,27.81
1/TX1/MISO1/CTX2/PWM  (via drill 0.35)
  Top 0.254: T4.1L.5 T4.1L.6 46.99,25.4 49.28,27.69 49.28,30.61 v48.9,30.99 | SPI1.4 53.83,62.21 v53.09,61.47
  Route15 0.254: v53.09,61.47 53.09,49.28 49.53,45.72 49.53,31.62 v48.9,30.99
2/PWM  (via drill 0.35)
  Top 0.254: T4.1L.8 T4.1L.7 36.45,27.94 34.42,25.91 v34.42,24.38 | S1,2.3 22.86,11.15 v22.86,12.45
  Route15 0.254: v22.86,12.45 34.42,24 v34.42,24.38
3/PWM  (via drill 0.35)
  Top 0.254: T4.1L.10 T4.1L.9 39.12,30.45 39.12,29.59 38.73,29.21 v38.48,29.21 | S1,2.6 29.49,10.29 30.73,10.29 31.62,11.18 v31.62,12.19
  Route15 0.254: v31.62,12.19 31.62,12.27 38.48,19.13 v38.48,29.21
4/PWM  (via drill 0.35)
  Top 0.254: T4.1L.12 T4.1L.11 39.08,32.04 39.12,32 39.37,31.75 39.5,31.62 v40.01,31.62 | S3,4.3 44.45,11.15 v44.45,12.32
  Route15 0.254: v44.45,12.32 41.15,15.62 41.15,30.48 v40.01,31.62
5/PWM  (via drill 0.35)
  Top 0.254: T4.1L.13 T4.1L.14 47.02,35.56 49.94,32.64 v50.42,32.64 | S3,4.6 52.07,11.27 v52.07,12.32
  Route15 0.254: v50.42,32.64 62.36,32.64 64.52,30.48 64.52,14.35 62.48,12.32 v52.07,12.32
6/PWM  (via drill 0.35)
  Top 0.254: T4.1L.16 T4.1L.15 v36.32,38.1
  Route15 0.254: v24.64,16.89 33.78,26.04 33.78,35.94 35.94,38.1 v36.32,38.1
  Bottom 0.254: S5,6.3 24.11,16.36 v24.64,16.89
7/RX2/PWM  (via drill 0.35)
  Top 0.254: T4.1L.18 T4.1L.17 v36.32,40.64
  Route15 0.254: v36.32,40.64 35.69,40.64 33.27,38.23 33.27,32 31.75,30.48 31.75,28.7 17.27,14.22 17.27,13.72 16.08,12.53 v14.86,12.53
  Bottom 0.254: 16.61,10.77 S5,6.6 14.86,11.78 v14.86,12.53
8/TX2/PWM  (via drill 0.35)
  Top 0.254: T4.1L.20 T4.1L.19 39.24,43.02 v39.24,41.91
  Route15 0.254: v39.24,41.91 39.24,33.53 42.55,30.23 42.55,21.84 45.53,18.86 45.53,13.91 v46.99,12.45
  Bottom 0.254: S7,8.3 46.99,11.32 v46.99,12.45
9/PWM  (via drill 0.35)
  Top 0.254: T4.1L.22 T4.1L.21 41.02,45.72 v41.78,44.96
  Route15 0.254: v38.1,16.51 38.1,17.4 39.75,19.05 39.75,30.23 38.56,31.42 38.56,43.51 40.01,44.96 v41.78,44.96
  Bottom 0.254: S7,8.6 38.2,16.41 v38.1,16.51
10/CS/PWM  (via drill 0.35)
  Top 0.254: T4.1L.24 T4.1L.23 36.45,48.26 v33.02,51.69
  Route15 0.254: v41.27,82.42 34.16,75.31 34.16,72.64 35.18,71.63 35.18,53.85 v33.02,51.69
  Bottom 0.254: SPI.1 50.55,92.69 50.55,91.26 50.59,91.22 50.59,88.31 44.7,82.42 v41.27,82.42
11/MOSI/CTX1/PWM  (via drill 0.35)
  Top 0.254: T4.1L.26 T4.1L.25 37.47,50.8 v35.56,52.7
  Route15 0.254: v42.16,81.53 37.51,76.88 36.42,76.88 35.74,76.2 35.69,76.2 35.05,75.56 35.05,72.37 35.61,71.81 35.61,52.76 v35.56,52.7
  Bottom 0.254: SPI.2 51.57,90.81 51.03,90.27 51.03,88.13 44.43,81.53 v42.16,81.53
12/MISO/PWM  (via drill 0.35)
  Top 0.254: T4.1L.28 T4.1L.27 37.21,53.34 36.7,53.85 v36.7,55.5
  Route15 0.254: v43.18,80.77 36.7,74.3 v36.7,55.5
  Bottom 0.254: SPI.3 52.57,91.58 52.58,91.57 52.58,88.9 44.45,80.77 v43.18,80.77
13/LED/SCK/PWM  (via drill 0.35)
  Top 0.254: T4.1R.27 26.8,53.34 T4.1R.28 31.24,53.34 v31.5,53.59
  Route15 0.254: v47.75,82.55 46.74,83.57 40.13,83.57 33.27,76.71 33.27,55.37 v31.5,53.59
  Bottom 0.254: SPI.4 53.57,89 47.75,83.19 v47.75,82.55
14/A0/TX3/PWM
  Top 0.254: T4.1R.25 T4.1R.26 30.61,50.8 37.41,43.99 46.56,43.99 49.91,40.64 49.91,40.39 53.45,36.85 S9,10.3
15/A1/RX3/PWM
  Top 0.254: S9,10.6 50.52,44.35 48.26,46.61 35.94,46.61 30.86,51.69 20.14,51.69 19.56,51.1 19.56,48.9 20.19,48.26 T4.1R.23
  Top 0.508: T4.1R.24 T4.1R.23
16/A2/RX4/SCL1  (via drill 0.35)
  Top 0.25: R4.2 55.5,78.61 57.13,80.24 WIRE1.4 59.94,83.31 v59.44,83.82 | v28.07,46.99 27.43,46.99 26.96,46.51 T4.1R.22
  Top 0.254: T4.1R.21 T4.1R.22
  Route15 0.25: v59.44,83.82 59.44,85.34 57.78,87 52.07,87 50.77,85.69 38.51,85.69 28.53,75.72 28.53,47.45 v28.07,46.99
17/A3/TX4/SDA1  (via drill 0.35)
  Top 0.25: R3.2 57.15,78.36 58.03,79.24 WIRE1.3 59.95,79.25 60.71,79.25 61.21,79.76 61.21,83.57 v60.96,83.82 | v27.3,44.45 27.3,43.53 T4.1R.20
  Top 0.254: T4.1R.19 T4.1R.20
  Route15 0.25: v60.96,83.82 60.96,84.45 57.91,87.5 51.97,87.5 50.59,86.12 38.33,86.12 28.1,75.89 28.1,47.99 27.39,47.27 27.39,44.53 v27.3,44.45
18/A4/SDA/PWM  (via drill 0.35)
  Top 0.25: WIRE.3 58.79,86.86 58.16,86.22 | R1.2 57.15,85.22 58.16,86.22 | 58.16,86.22 v56.4,86.22 v56.39,86.23 | v27.05,41.91 26.96,41.81 T4.1R.18
  Top 0.254: T4.1R.17 T4.1R.18
  Route15 0.25: v56.39,86.23 52.2,86.23 51.23,85.27 38.68,85.27 28.96,75.54 28.96,42.42 28.45,41.91 v27.05,41.91
19/A5/SCL/PWM  (via drill 0.35)
  Top 0.25: WIRE.4 56.11,87.86 55.5,87.25 55.5,86.11 | 55.5,86.11 R2.2 | 55.5,86.11 54.86,85.47 v52.83,85.47 | v28.96,38.73 28.32,38.1 T4.1R.16
  Top 0.254: T4.1R.15 T4.1R.16
  Route15 0.25: v52.83,85.47 52.2,84.84 38.86,84.84 33.32,79.3 33.32,77.36 32.84,76.89 32.84,56.97 30.61,54.74 30.61,42.77 29.41,41.58 29.41,39.19 v28.96,38.73
20/A6/TX5  (via drill 0.35)
  Top 0.254: T4.1R.13 T4.1R.14 28.96,35.56 v29.46,36.07
  Route15 0.254: v29.46,36.07 29.84,36.45 29.84,41.4 37.47,49.02 37.47,56.9 40.39,59.82 v44.96,59.82
  Bottom 0.254: SERIAL_8_5.1 12.47,91.54 13.72,90.3 19.05,90.3 24.77,84.58 36.07,84.58 48.9,71.75 48.9,64.52 49.68,64.52 51.38,62.81 53.01,62.81 53.61,62.21 GNSS.3 50.53,62.21 48.13,59.82 v44.96,59.82
21/A7/RX5  (via drill 0.35)
  Top 0.254: T4.1R.11 T4.1R.12 28.57,33.02 v29.72,34.16
  Route15 0.254: v29.72,34.16 30.35,34.8 30.35,41.15 38.1,48.9 38.1,56.13 39.24,57.28 v44.83,57.28
  Bottom 0.254: SERIAL_8_5.2 13.47,91.56 14.3,90.73 19.38,90.73 24.89,85.22 36.32,85.22 49.4,72.14 49.4,65.41 51.56,63.25 58.42,63.25 58.74,62.93 58.74,60.01 58.44,59.71 GNSS.4 55.99,59.69 50.55,59.69 48.13,57.28 v44.83,57.28
22/A8/CTX1/PWM  (via drill 0.35)
  Top 0.254: T4.1R.9 T4.1R.10 30.35,30.48 36.7,36.83 49.02,36.83 v50.55,38.35
  Bottom 0.254: S11,12.3 51.54,39.35 v50.55,38.35
23/A9/CRX1/PWM  (via drill 0.35)
  Top 0.254: T4.1R.7 T4.1R.8 30.73,27.94 v32.64,29.84
  Bottom 0.254: S11,12.6 40.74,31.85 40.29,32.31 35.1,32.31 v32.64,29.84
24/A10/TX6/SCL2/PWM  (via drill 0.35)
  Top 0.254: T4.1L.31 T4.1L.32 v47.5,58.42 | v62.1,13.97 62.17,13.91 RPI_16P.5
  Route15 0.254: v47.5,58.42 48.77,57.15 48.77,49.4 46.23,46.86 46.23,29.72 47.88,28.07 47.88,19.81 52.45,15.24 55.24,15.24 v56.52,16.51
  Bottom 0.254: WIRE2_AND_PIWIRE.4 59.94,20.7 61.34,19.3 61.34,18.41 60.83,17.91 58.13,17.91 R6.2 58.29,17.49 58.29,16.89 | 58.29,16.89 58.29,16.76 61.09,13.97 v62.1,13.97 | 58.29,16.89 57.91,16.51 v56.52,16.51
25/A11/RX6/SDA2/PWM  (via drill 0.35)
  Top 0.254: T4.1L.33 T4.1L.34 v48.01,60.96 | v60.25,19.05 63.88,19.05 64.77,18.16 64.77,10.67 64.26,10.16 RPI_16P.3
  Route15 0.254: v57.02,21.59 57.02,18.92 53.85,15.75 53.09,15.75 48.39,20.45 48.39,28.5 46.84,30.05 46.84,30.78 46.81,30.81 46.81,46.51 49.28,48.97 49.28,59.69 v48.01,60.96
  Bottom 0.254: v60.25,19.05 59.05,19.05 58.8,19.3 R5.2 58,21.17 59.19,22.36 WIRE2_AND_PIWIRE.3 57.79,22.36 v57.02,21.59
26/A12/MOSI1
  Top 0.254: T4.1L.35 T4.1L.36 48.13,63.5 53.09,58.55 58.55,58.55 59.18,59.18 59.18,64.26 58.73,64.71 SPI1.5
27/A13/SCK1
  Top 0.254: T4.1L.37 T4.1L.38 47.24,66.04 53.57,59.71 SPI1.3
28/RX7/PWM  (via drill 0.35)
  Top 0.254: T4.1L.39 T4.1L.40 45.93,68.58 v47.32,67.18 | RPI_16P.8 55.19,15.24 v53.57,16.86
  Route15 0.254: v53.57,16.86 52.32,18.11 52.32,18.82 48.84,22.3 48.84,28.65 47.27,30.23 47.27,30.96 47.24,30.99 47.24,32 48.16,32.92 48.16,47.24 50.11,49.2 50.11,61.67 47.57,64.21 47.57,66.93 v47.32,67.18
29/TX7/PWM  (via drill 0.35)
  Top 0.254: T4.1L.41 T4.1L.42 46.61,71.12 48.01,69.72 v48.01,67.94 | v53.98,17.78 RPI_16P.10
  Route15 0.254: v48.01,67.94 48.01,64.39 50.55,61.85 50.55,49.02 48.59,47.07 48.59,32.69 47.7,31.8 47.7,30.4 49.28,28.83 49.28,22.48 v53.98,17.78
30/CRX3  (via drill 0.35)
  Top 0.254: T4.1L.44 T4.1L.43 38.86,73.88 v38.86,74.93
  Bottom 0.254: R7.2 17,83.45 R8.1 25.87,83.1 31.75,77.22 37.08,77.22 38.86,75.44 v38.86,74.93
31/CTX3  (via drill 0.35)
  Top 0.254: T4.1L.46 T4.1L.45 v36.7,76.2
  Bottom 0.254: R11.2 17,73.45 R12.1 32.71,73.1 35.81,76.2 v36.7,76.2
32
  Top 0.178: OPENIMU300ZI.8A 31.52,83.42 36.2,78.74 T4.1L.47
  Top 0.254: T4.1L.48 T4.1L.47
33/PWM  (via drill 0.35)
  Top 0.254: T4.1R.47 T4.1R.48 29.34,78.74 30.54,77.53 31.75,76.33 31.75,63.37 v31.88,63.25
  Bottom 0.254: R16.1 17,58.45 R15.2 18.09,59.75 21.59,63.25 v31.88,63.25
34/RX8  (via drill 0.35)
  Top 0.254: T4.1R.46 T4.1R.45 19.56,76.2 19.18,76.58 19.18,81.28 v25.53,87.63
  Bottom 0.254: SERIAL_8_5.4 15.47,91.74 15.62,91.59 20.4,91.59 21.57,90.42 22.73,90.42 v25.53,87.63
35/TX8  (via drill 0.35)
  Top 0.254: T4.1R.44 T4.1R.43 19.81,73.66 18.41,75.06 18.41,82.42 v23.75,87.76
  Bottom 0.254: SERIAL_8_5.3 14.47,91.58 14.88,91.16 20.22,91.16 21.39,89.99 21.51,89.99 v23.75,87.76
36/CS/PWM  (via drill 0.35)
  Top 0.254: T4.1R.41 T4.1R.42 28.83,71.12 30.86,69.09 v30.86,62.48
  Bottom 0.254: R20.1 17,48.45 R19.2 17.62,49.75 21.46,53.59 21.46,59.18 24.77,62.48 v30.86,62.48
37/CS/PWM  (via drill 0.35)
  Top 0.254: T4.1R.39 T4.1R.40 28.96,68.58 29.72,67.82 v29.72,61.59
  Bottom 0.254: R22.1 17,38.45 R21.2 18.16,39.75 | 18.16,39.75 | 18.16,39.75 18.8,39.75 29.72,50.67 v29.72,61.59
38/A14/CS1  (via drill 0.35)
  Top 0.254: T4.1R.38 T4.1R.37 19.56,66.04 19.05,65.53 v19.05,64.59
  Bottom 0.254: R18.1 R17.2 15.65,64.29 15.95,64.59 v19.05,64.59
39/A15/MISO1  (via drill 0.35)
  Top 0.254: T4.1R.36 T4.1R.35 18.92,63.5 17.91,64.52 17.91,67.18 18.54,67.82 v18.54,73.79
  Bottom 0.254: R13.2 15.65,78.74 | 15.65,78.74 15.65,79.28 15.81,79.44 | 15.81,79.44 15.88,79.5 | R14.1 14.09,78.74 15.65,78.74 | 15.81,79.44 18.48,79.44 18.54,79.38 v18.54,73.79
40/A16  (via drill 0.35)
  Top 0.254: T4.1R.33 T4.1R.34 27,60.91 30.69,60.91 32.64,62.87 v32.64,77.98
  Bottom 0.254: R10.1 R9.2 15.75,88.6 15.75,89.28 15.88,89.41 18.41,89.41 24.29,83.53 26.05,83.53 31.6,77.98 v32.64,77.98
41/A17
  Top 0.254: T4.1R.31 T4.1R.32
  Top 0.305: T4.1R.31 18.67,58.42 16.93,56.68 R33.2 16.89,55.84 R32.1
+3V3  (via drill 0.35)
  Top 0.406: T4.1R.5 T4.1R.6
  Top 0.508: WIRE1.2 59.06,78.24 58.42,77.6 58.42,76.33 57.82,75.73 R3.1 | WIRE.2 58.94,85.86 58.42,85.34 58.42,83.19 58.17,82.93 56.81,82.93 56.77,82.97 | 57.15,52.45 58.42,51.18 58.42,46.99 62.23,43.18 62.23,31.62 59.82,29.21 v59.82,27.94 | T4.1L.29 39.08,54.64 v39.12,54.61 | v28.57,26.8 27.69,26.8 26.96,26.07 T4.1R.6
  Top 0.61: T4.1L.29 T4.1L.30 | R4.1 54.95,75.73 54.1,76.58 54.1,82.3 54.78,82.97 R2.1 56.77,82.97 R1.1
  Top 0.813: T4.1L.30 50.16,55.88 53.59,52.45 57.15,52.45 59.82,52.45 60.83,53.47 61.85,53.47 62.99,54.61 62.99,66.6 57.15,72.44 R3.1 R4.1
  Route15 0.508: v39.12,54.61 39.12,48.64 31.24,40.77 31.24,34.16 30.23,33.15 30.23,28.45 v28.57,26.8
  Bottom 0.254: R6.1 R5.1 56.26,19.34 56.26,22.35 57.27,23.36 WIRE2_AND_PIWIRE.2
  Bottom 0.508: WIRE2_AND_PIWIRE.2 61.21,23.36 61.47,23.62 61.47,25.53 59.82,27.18 v59.82,27.94
+5V  (via drill 0.35, 0.64)
  Top 0.508: v29.21,16.51 29.21,14.35 | v31.75,16.51 31.75,14.35 | v36.83,16.51 36.83,14.35 | v41.91,16.51 41.91,14.35 | v46.99,16.51 46.99,14.35 | v34.29,16.51 34.29,14.35 | v39.37,16.51 39.37,14.35 | v44.45,16.51 44.45,14.35 | v49.53,16.51 49.53,14.35 | T4.1R.2 26.67,20.03 | 15.24,29.84 17.4,29.84 v18.03,29.21 | OPENIMU300ZI.10A 32.52,92.32 33.15,91.69 33.52,92.07 OPENIMU300ZI.12A OPENIMU300ZI.11A
  Top 0.813: T4.1R.1 T4.1R.2 | S1,2.2 19.11,14.29 | 26.67,14.35 26.67,9.96 S1,2.5 | 40.64,14.35 40.7,14.29 S3,4.2 | S3,4.5 48.2,13.14 46.99,14.35 | T4.1R.1 22.86,18.76 22.86,14.35 | T4.1R.1 19.05,20.32 15.24,24.13 15.24,25.02 | SPI1.1 60.86,54.71 v60.96,54.61 | IMU_JUMPER.02 53.72,87.76 53.09,87.12 50.8,87.12 37.72,87.12 33.15,91.69
  Top 1.016: RPI_16P.4 RPI_16P.2 | 50.8,87.12 51.69,86.23 51.69,73.53 56.55,68.67 59.38,68.67 60.25,67.8 60.25,60.53 61.09,59.69 61.09,54.94 60.86,54.71
  Top 1.27: 51.44,14.35 53.34,14.35 53.85,13.84 53.85,11.18 54.86,10.16 RPI_16P.4
  Top 1.905: v15.24,15.24 15.24,25.02 15.24,29.84 P5.1
  Top 2.54: 19.05,14.35 22.86,14.35 26.67,14.35 29.21,14.35 31.75,14.35 34.29,14.35 36.83,14.35 39.37,14.35 40.64,14.35 41.91,14.35 44.45,14.35 46.99,14.35 49.53,14.35 51.44,14.35 | 19.11,14.29 19.05,14.35 | v15.24,15.24 16.13,14.35 19.05,14.35
  Bottom 0.305: BUCK_6-36V_TO_5V.1 17.71,28.89 v18.03,29.21 | R24.1 22.26,18.16 C1.2
  Bottom 0.508: C1.2 29.21,16.89 | 29.21,16.89 C2.2 31.75,16.89 | 29.21,16.89 v29.21,16.51 | 31.75,16.89 C3.2 34.29,16.89 | 31.75,16.89 v31.75,16.51 | 36.83,16.89 C4.2 34.29,16.89 | 36.83,16.89 C5.2 39.37,16.89 v39.37,16.51 40.64,17.78 C6.2 41.91,16.89 | 36.83,16.89 v36.83,16.51 | 41.91,16.89 C7.2 43.18,17.78 v44.45,16.51 44.45,16.89 C8.2 46.99,16.89 | 41.91,16.89 v41.91,16.51 | 46.99,16.89 C9.2 49.53,16.89 v49.53,16.51 50.8,17.78 C10.2 | 46.99,16.89 v46.99,16.51 | 34.29,16.89 v34.29,16.51
  Bottom 0.813: S7,8.2 48.2,15.18 | 48.2,15.18 v49.53,16.51 | 48.2,15.18 48.2,15.3 v46.99,16.51 | S7,8.5 40.7,15.3 | 40.7,15.3 v41.91,16.51 | 40.7,15.3 39.49,16.51 v39.37,16.51 | S5,6.5 19.11,13.28 17.14,15.24 v15.24,15.24 | S5,6.2 26.61,13.91 v29.21,16.51 | C10.2 52.2,18.16 53.47,19.43 53.47,22.1 51.69,23.88 51.69,26.54 54.1,28.96 58.42,28.96 62.61,33.15 62.61,43.69 59.31,46.99 59.31,52.07 60.96,53.72 v60.96,54.61 60.96,63.5 59.75,64.71 GNSS.2
  Bottom 1.905: L1-1UH.1 v15.24,15.24
BIAS/FB  (via drill 0.35)
  Route15 0.305: v16.51,30.79 v16.51,35.18
  Bottom 0.305: BUCK_6-36V_TO_5V.13 14.49,28.94 14.73,28.7 15.57,28.7 15.99,29.12 BUCK_6-36V_TO_5V.16 15.99,30.27 v16.51,30.79 | v16.51,35.18 C15.1
BST
  Bottom 0.305: BUCK_6-36V_TO_5V.3 19.23,27.89 19.6,27.52 C16.2
BUCK_RST
  Bottom 0.305: BUCK_6-36V_TO_5V.2 19.12,28.39 19.18,28.45 21.08,28.45 22.23,27.3 R23.2
COMP
  Bottom 0.305: BUCK_6-36V_TO_5V.15 15.49,31.11 15.88,31.5 22.86,31.5 | 22.86,31.5 22.99,31.62 24.38,33.02 R28.2 | 22.86,31.5 23.62,30.73 C12.2
FOSC  (via drill 0.35)
  Route15 0.305: v18.92,29.97 19.43,29.46 v29.21,29.46
  Bottom 0.305: BUCK_6-36V_TO_5V.17 17.45,29.65 17.78,29.97 v18.92,29.97 | v29.21,29.46 29.21,29.08 30.23,28.07 R25.1
GND  (via drill 0.35, 0.4, 0.55, 0.6)
  Top 0.254: OPENIMU300ZI.15A OPENIMU300ZI.13A 34.52,95.53 | T4.1R.29 21.59,55.88 v24.13,55.88 T4.1R.30 | 34.52,95.53 v34.54,95.5 | OPENIMU300ZI.14A 34.52,95.53 | IMU_JUMPER.06 v48.64,88.27
  Top 0.305: R33.1 21.59,55.88
  Top 0.406: T4.1R.4 v24.13,22.86 T4.1R.3 | T4.1L.2 v41.91,20.32 T4.1L.1 | RPI_16P.6 57.21,13.97 v57.28,13.97
  Top 0.61: WIRE.1 61.83,84.86 v61.85,84.84 | WIRE1.1 61.57,77.24 v61.59,77.22
  Top 0.813: S1,2.1 16.51,9.8 v16.51,6.35 | S1,2.4 24.13,9.88 v24.13,6.35 | S3,4.1 38.2,6.45 v38.1,6.35 | S3,4.4 45.7,6.37 v45.72,6.35 | RPI_16P.9 60.9,16.51 v59.94,16.51 | SPI1.2 59.63,57.21 v59.69,57.15 | S9,10.1 v56.14,30.61 v56.13,30.61
  Top 1.016: RPI_16P.14 v54.1,22.86
  Top 1.27: RPI_16P.14 56.9,22.86 | S9,10.4 59.71,39.35 v60.96,38.1
  Route2 0.508: 11.68,22.73 11.43,22.99 11.43,24.13 | 11.68,28.07 11.43,27.81 11.43,26.67
  Bottom 0.254: R21.1 15.67,41.45 v15.49,41.27 | v15.24,86.36 16.91,86.36 R7.1 17.35,86.8 R9.1 | v15.24,76.2 15.49,76.45 R11.1 17.35,76.8 R13.1 | v15.24,61.34 16.89,61.34 R15.1 17.35,61.8 R17.1 | R19.1 16.73,51.18 v15.37,51.18
  Bottom 0.305: BUCK_6-36V_TO_5V.14 14.99,32.22 | 14.99,32.22 v14.97,32.24 | BUCK_6-36V_TO_5V.12 13.99,31.22 14.99,32.22 | 26.04,24.77 v24.13,22.86 23.62,23.37 C12.1 C11.1 26.16,24.89 26.04,24.77 | R27.2 26.04,24.77
  Bottom 0.406: C10.1 C9.1 C8.1 C7.1 C6.1 C5.1 C4.1 C3.1 C2.1 C1.1 | BUCK_6-36V_TO_5V.8 12.76,27.24 v12.45,26.92 12.78,26.59 BUCK_6-36V_TO_5V.7
  Bottom 0.508: v24.13,22.86 25.4,21.59 27.81,21.59 C1.1 29.08,20.32 v29.21,20.32 29.34,20.32 C2.1 30.61,21.46 v31.75,20.32 31.88,20.32 C3.1 33.15,21.46 v34.29,20.32 34.42,20.32 C4.1 36.7,20.32 v36.83,20.32 36.96,20.32 C5.1 38.35,21.46 | C10.1 49.66,20.32 v49.53,20.32 49.4,20.32 C9.1 47.12,20.32 | 47.12,20.32 v46.99,20.32 | C8.1 45.97,21.46 47.12,20.32 | 43.43,21.46 C7.1 42.04,20.32 | 42.04,20.32 v41.91,20.32 | C6.1 40.89,21.46 42.04,20.32 | BUCK_6-36V_TO_5V.4 17.97,27.24 v18.29,26.92 17.95,26.59 BUCK_6-36V_TO_5V.5 | WIRE2_AND_PIWIRE.1 55.48,24.36 54.1,22.99 v54.1,22.86
  Bottom 0.61: C15.2 14.99,33.14 14.99,32.22
  Bottom 0.813: C13.2 12.15,26.96 v12.45,26.92 | C14.2 9.27,18.29 11.18,20.19 C13.2 | B1_OUT.2 9.21,25 C13.2 | S7,8.1 50.7,6.45 v50.8,6.35 | S7,8.4 43.2,6.37 v43.18,6.35 | S5,6.1 29.11,6.38 v29.08,6.35 | S5,6.4 21.61,6.37 v21.59,6.35 | M5.1 14.86,41.91 v15.49,41.27 14.85,40.63 M5.2 14.74,40.63 v15.49,39.88 14.98,39.37 M5.3 | M4.1 14.64,51.91 v15.37,51.18 14.82,50.63 M4.2 14.77,50.63 v15.37,50.04 14.69,49.37 M4.3 | M3.1 14.68,61.91 v15.24,61.34 14.53,60.63 M3.2 14.55,60.63 v15.24,59.94 14.66,59.37 M3.3 | M2.1 14.54,76.91 v15.24,76.2 14.68,75.64 M2.2 14.54,75.64 v15.24,74.93 14.68,74.36 M2.3 | M1.1 14.7,86.91 v15.24,86.36 14.52,85.64 M1.2 14.44,85.64 v15.24,84.84 14.77,84.36 M1.3 | GNSS.1 59.16,67.21 v59.18,67.18
  Bottom 1.27: B1_IN.2 6.75,15 7.62,15.88 C14.2 | S11,12.4 59.71,36.85 v60.96,38.1 | S11,12.1 59.66,44.35 v59.69,44.32
  pour Route2: -7.62,116.84 -13.97,116.84 -20.32,110.49 -20.32,-7.62 -15.24,-12.7 -11.43,-16.51 77.47,-16.51 80.01,-16.51 88.9,-7.62 92.71,-3.81 92.71,104.14 82.55,114.3 81.28,114.3 78.74,116.84
IMU3-TX-SCK
  Top 0.2: IMU_IN.4 13.74,93.5 14.48,94.23 18.87,94.23 21.91,97.28 24.52,97.28 25.91,95.89 29.34,95.89 29.52,96.06 OPENIMU300ZI.3A
IMU4-RX-MISO
  Top 0.2: IMU_IN.3 14.74,91.7 14.73,91.69 14.99,91.44 28.83,91.44 29.52,92.13 OPENIMU300ZI.4A
IMU5-TX1-MOSI
  Top 0.2: IMU_IN.2 15.74,93.21 16.38,93.85 19.02,93.85 22.06,96.9 24.37,96.9 25.76,95.5 30.1,95.5 30.52,95.92 OPENIMU300ZI.5A
IMU6-RX1-CS
  Top 0.2: OPENIMU300ZI.6A 30.52,94.7 30.1,95.12 25.61,95.12 24.22,96.51 24.14,96.51 24.13,96.52 24.12,96.51 22.21,96.51 18.41,92.71 IMU_IN.1
IMU7-UART/SPI-SEL  (via drill 0.35)
  Top 0.178: 51.12,90.81 IMU_JUMPER.04
  Top 0.254: OPENIMU300ZI.7A 31.52,95.53 v31.5,95.5 | v49.91,90.93 51.12,90.93 IMU_JUMPER.04
  Route15 0.254: v31.5,95.5 32,95.5 32.89,96.39 39.88,96.39 40.51,97.03 43.43,97.03 49.53,90.93 v49.91,90.93
IMU16-SWDIO
  Top 0.178: OPENIMU300ZI.16A 35.52,92.49 36.96,91.06 44.45,91.06 46.48,93.09 53.21,93.09 53.72,93.6 IMU_JUMPER.01
IMU17-TX2  (via drill 0.35)
  Top 0.254: v36.45,95.5 36.45,96.78 OPENIMU300ZI.17A
  Bottom 0.254: GNSS.5 58.48,57.21 59.56,58.29 59.56,62.87 58.75,63.68 52.07,63.68 50.04,65.71 50.04,72.14 36.45,85.72 v36.45,95.5
IMU18-SWCLK
  Top 0.178: OPENIMU300ZI.18A 36.52,92.64 37.59,91.57 44.32,91.57 46.23,93.47 50.93,93.47 51.18,93.73 IMU_JUMPER.03
IMU19-RX2  (via drill 0.35)
  Top 0.254: v37.47,95.5 37.47,96.79 OPENIMU300ZI.19A
  Route15 0.25: v51.31,58.93 51.31,66.17 53.98,68.83 62.1,68.83 64.64,71.37 64.64,89.92 62.99,91.57 52.7,91.57 51.39,90.25 49.63,90.25 49.58,90.3 47.24,90.3 45.88,91.66 41.91,91.66 41.75,91.66 41.31,91.66 v37.47,95.5
  Bottom 0.254: GNSS.6 52.86,54.71 51.31,56.26 v51.31,58.93
IMU20-VREF_SWD
  Top 0.178: OPENIMU300ZI.20A 38.92,93.65 41.77,96.5 43.76,96.5 44.44,95.82 IMU_JUMPER.05
LX
  Bottom 0.305: C16.1 20.28,25.78 15.24,25.78
  Bottom 0.813: 15.24,25.78 BUCK_6-36V_TO_5V.6
  Bottom 1.27: L1-1UH.2 15.24,25.78
N$2
  Bottom 0.254: M1.4 R8.2
N$5
  Bottom 0.254: M5.4 R22.2
N$8
  Bottom 0.305: R23.1 R24.2
N$10
  Bottom 0.254: R12.2 M2.4
N$12
  Bottom 0.305: R25.2 32.89,28.03 R26.1
N$13
  Bottom 0.305: R26.2 32.85,24.77 R27.1
N$14
  Bottom 0.305: R30.1 R31.2
N$15
  Bottom 0.305: R29.1 26.12,35.43 R30.2
N$16
  Bottom 0.305: R28.1 24.38,37.05 R29.2
N$17
  Bottom 0.254: M3.4 R16.2
N$19
  Bottom 0.305: R31.1 C11.2
N$24
  Bottom 0.254: M4.4 R20.2
P1D
  Bottom 0.254: M1.5 12.06,87.12 12.06,88.42 R10.2
  Bottom 2.54: P1.2 M1.5
P2D
  Bottom 0.254: M2.5 12.06,77.12 12.06,78.42 R14.2
  Bottom 2.54: P2.2 M2.5
P3D
  Bottom 0.254: 9.94,58.89 M3.5 12.06,62.12 12.06,63.41 R18.2
  Bottom 2.54: P3.2 7.5,55 9.94,57.44 M3.5
P4D
  Bottom 2.54: P4.2 7.54,45 9.94,47.41 M4.5
P5D
  Bottom 2.54: P5.2 7.7,35 9.94,37.24 M5.5
VCC_1
  Top 0.254: R32.2 16.89,50.29 9.14,42.55 4.06,42.55 1.78,40.26 1.78,33.3 B1_OUT.1
  Top 2.54: B1_OUT.1 2.36,27.28 2.36,22.72 B1_IN.1
  Bottom 0.406: BUCK_6-36V_TO_5V.10 11.45,28.39 C13.1 11.4,28.89 BUCK_6-36V_TO_5V.11
  Bottom 0.508: BUCK_6-36V_TO_5V.9 11.95,27.89 C13.1
  Bottom 0.813: B1_IN.1 5.15,20.07 C14.1
  Bottom 1.27: C13.1 6.42,28.66
  Bottom 1.905: 6.42,28.66 B1_OUT.1
VCC_2  (via drill 0.35)
  Top 1.27: S9,10.5 53.78,41.85 v52.7,42.93 | S9,10.2 52.9,34.35 v51.31,35.94
  Top 2.54: P1.1 2.36,87.28 2.36,82.72 P2.1 2.36,77.28 2.36,72.72 B2_IN.1 2.36,67.28 2.36,62.48 4.85,60 P3.1 2.36,57.28 2.36,52.72 P4.1
  Bottom 1.27: S11,12.2 50.48,41.85 49.4,42.93 v52.7,42.93 | S11,12.5 50.61,34.35 49.02,35.94 | 46.86,38.1 46.86,45.47 | v51.31,35.94 49.02,35.94 | 49.02,35.94 48.45,36.51
  Bottom 1.905: 42.55,49.78 46.86,45.47 49.4,42.93 | 48.45,36.51 46.86,38.1
  Bottom 2.54: B2_IN.1 8.66,66.42 35.05,66.42 42.55,58.93 42.55,49.78

### Text on the board
tPlace: CALIPSO V3.0 PCB / Updated 6/18/2021